# Altium project Apalis-Smart-Vision-Baseboard-Rev.1.2.1.PrjPcb (part 2 of 2)
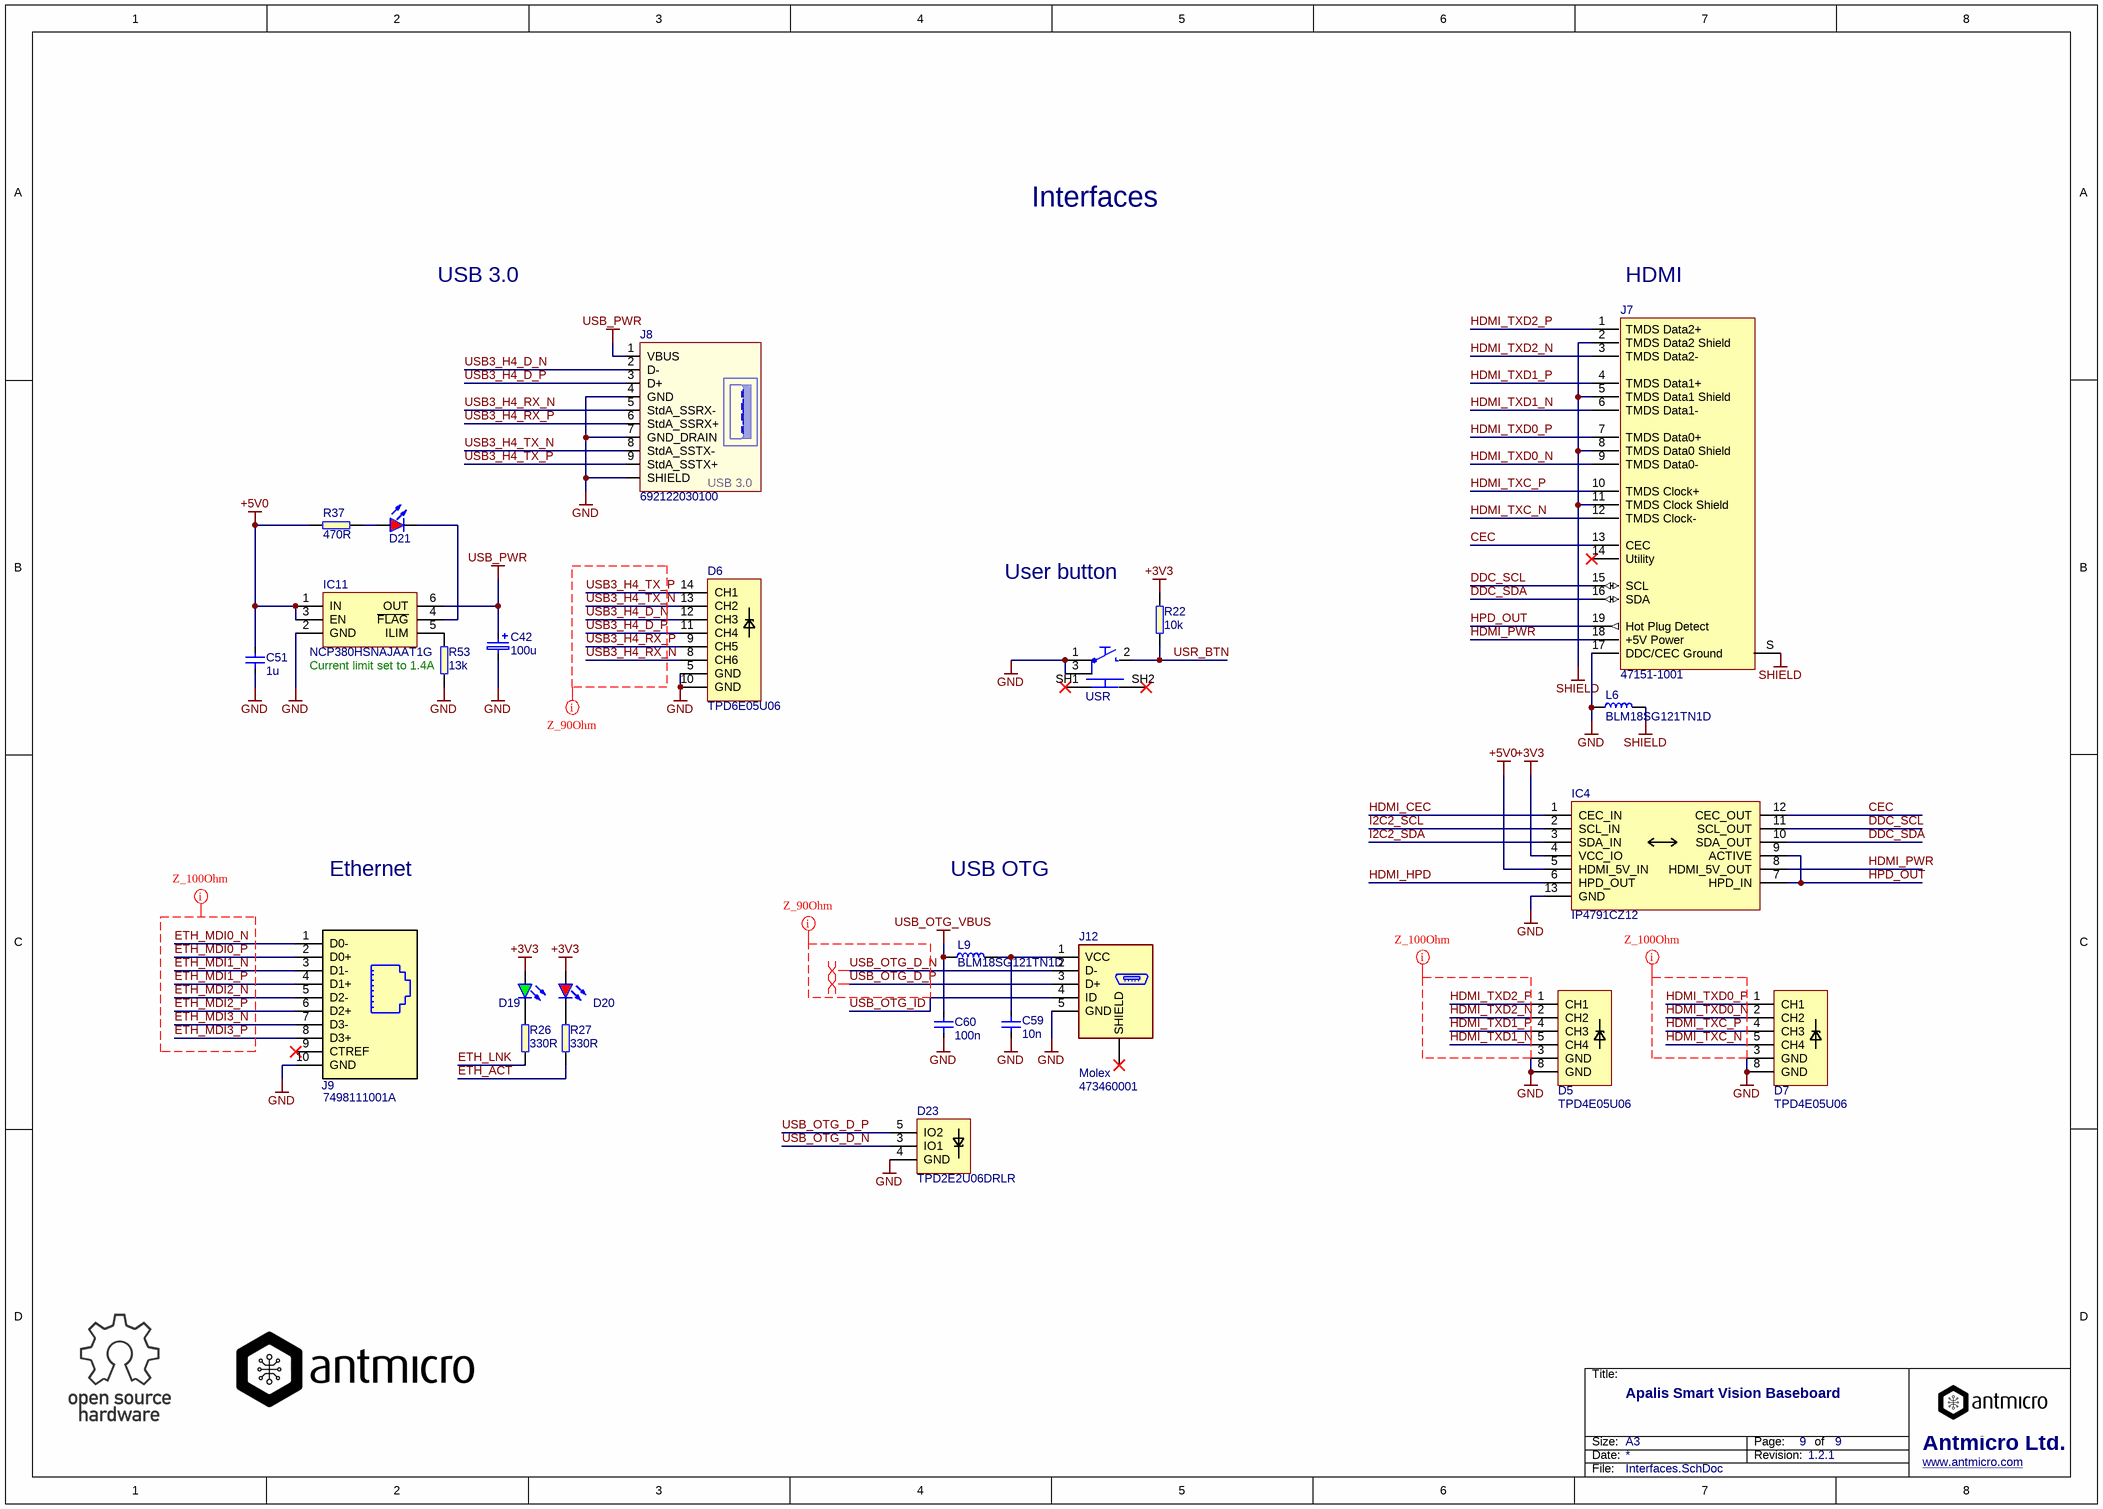
[diagram p9: Interfaces.SchDoc]

## Nets that join several sheets
+1V5: Power-Supply (C2.2 IC1.4 L1.2 TP5.1), PCIe-SATA (12 pins)
+3V3: Power-Supply (6 pins), SoM-Supply (28 pins), SoM-LowSpeed (6 pins), PCIe-SATA (23 pins), Camera-Interface (J6.47 J6.48), Peripherals (15 pins), Interfaces (D19.A D20.A IC4.4 R22.2)
+5V0: Power-Supply (7 pins), SoM-Supply (Q2.2 R10.2), Debug-UART (D3.2), Camera-Interface (J6.49 J6.50), Interfaces (5 pins)
GND: Power-Supply (31 pins), SoM-Supply (59 pins), PCIe-SATA (48 pins), Debug-UART (13 pins), Camera-Interface (24 pins), Peripherals (18 pins), Interfaces (23 pins)
USB_OTG_VBUS: SoM-HighSpeed (M1.60 TP9.1), Interfaces (C60.2 L9.1)
CSI1_CLK_N: SoM-HighSpeed (M1.161), Camera-Interface (IC23.5)
CSI1_CLK_P: SoM-HighSpeed (M1.163), Camera-Interface (IC23.4)
CSI1_D1_N: SoM-HighSpeed (M1.155), Camera-Interface (IC15.5)
CSI1_D1_P: SoM-HighSpeed (M1.157), Camera-Interface (IC15.4)
CSI1_D2_N: SoM-HighSpeed (M1.149), Camera-Interface (IC17.5)
CSI1_D2_P: SoM-HighSpeed (M1.151), Camera-Interface (IC17.4)
CSI1_D3_N: SoM-HighSpeed (M1.143), Camera-Interface (IC19.5)
CSI1_D3_P: SoM-HighSpeed (M1.145), Camera-Interface (IC19.4)
CSI1_D4_N: SoM-HighSpeed (M1.137), Camera-Interface (IC21.5)
CSI1_D4_P: SoM-HighSpeed (M1.139), Camera-Interface (IC21.4)
CSI2_CLK_N: SoM-HighSpeed (M1.131), Camera-Interface (IC22.5)
CSI2_CLK_P: SoM-HighSpeed (M1.133), Camera-Interface (IC22.4)
CSI2_D1_N: SoM-HighSpeed (M1.95), Camera-Interface (IC13.5)
CSI2_D1_P: SoM-HighSpeed (M1.97), Camera-Interface (IC13.4)
CSI3_CLK_N: SoM-HighSpeed (M1.125), Camera-Interface (IC20.5)
CSI3_CLK_P: SoM-HighSpeed (M1.127), Camera-Interface (IC20.4)
CSI3_D1_N: SoM-HighSpeed (M1.119), Camera-Interface (IC12.5)
CSI3_D1_P: SoM-HighSpeed (M1.121), Camera-Interface (IC12.4)
CSI3_D2_N: SoM-HighSpeed (M1.113), Camera-Interface (IC14.5)
CSI3_D2_P: SoM-HighSpeed (M1.115), Camera-Interface (IC14.4)
CSI3_D3_N: SoM-HighSpeed (M1.107), Camera-Interface (IC16.5)
CSI3_D3_P: SoM-HighSpeed (M1.109), Camera-Interface (IC16.4)
CSI3_D4_N: SoM-HighSpeed (M1.101), Camera-Interface (IC18.5)
CSI3_D4_P: SoM-HighSpeed (M1.103), Camera-Interface (IC18.4)
ETH_ACT: SoM-HighSpeed (M1.42), Interfaces (R27.2)
ETH_LNK: SoM-HighSpeed (M1.44), Interfaces (R26.2)
ETH_MDI0_N: SoM-HighSpeed (M1.48), Interfaces (J9.1)
ETH_MDI0_P: SoM-HighSpeed (M1.50), Interfaces (J9.2)
ETH_MDI1_N: SoM-HighSpeed (M1.54), Interfaces (J9.3)
ETH_MDI1_P: SoM-HighSpeed (M1.56), Interfaces (J9.4)
ETH_MDI2_N: SoM-HighSpeed (M1.34), Interfaces (J9.5)
ETH_MDI2_P: SoM-HighSpeed (M1.32), Interfaces (J9.6)
ETH_MDI3_N: SoM-HighSpeed (M1.40), Interfaces (J9.7)
ETH_MDI3_P: SoM-HighSpeed (M1.38), Interfaces (J9.8)
FAN_START: SoM-Supply (R12.1), SoM-LowSpeed (M1.11)
GPIO1: SoM-LowSpeed (M1.1), Camera-Interface (D12.14 J6.31)
GPIO2: SoM-LowSpeed (M1.3), Camera-Interface (D12.13 J6.32)
GPIO3: SoM-LowSpeed (M1.5), Camera-Interface (D12.12 J6.33)
GPIO4: SoM-LowSpeed (M1.7), Camera-Interface (D12.11 J6.34)
HDMI_CEC: SoM-HighSpeed (M1.220), Interfaces (IC4.1)
HDMI_HPD: SoM-HighSpeed (M1.232), Interfaces (IC4.6)
HDMI_TXC_N: SoM-HighSpeed (M1.242), Interfaces (D7.5 J7.12)
HDMI_TXC_P: SoM-HighSpeed (M1.240), Interfaces (D7.4 J7.10)
HDMI_TXD0_N: SoM-HighSpeed (M1.236), Interfaces (D7.2 J7.9)
HDMI_TXD0_P: SoM-HighSpeed (M1.234), Interfaces (D7.1 J7.7)
HDMI_TXD1_N: SoM-HighSpeed (M1.230), Interfaces (D5.5 J7.6)
HDMI_TXD1_P: SoM-HighSpeed (M1.228), Interfaces (D5.4 J7.4)
HDMI_TXD2_N: SoM-HighSpeed (M1.224), Interfaces (D5.2 J7.3)
HDMI_TXD2_P: SoM-HighSpeed (M1.222), Interfaces (D5.1 J7.1)
I2C1_SCL: SoM-LowSpeed (M1.211 R42.1 TP11.1), PCIe-SATA (R14.1), Camera-Interface (D13.8 J6.42), Peripherals (IC10.10)
I2C1_SDA: SoM-LowSpeed (M1.209 R43.1 TP10.1), PCIe-SATA (R15.1), Camera-Interface (D13.9 J6.41), Peripherals (IC10.9)
I2C2_SCL: SoM-LowSpeed (M1.207 R36.1), Interfaces (IC4.2)
I2C2_SDA: SoM-LowSpeed (M1.205 R35.1), Interfaces (IC4.3)
I2C3_SCL: SoM-LowSpeed (M1.203 R34.1 TP15.1), Camera-Interface (D13.11 J6.40), Peripherals (IC9.6)
I2C3_SDA: SoM-LowSpeed (M1.201 R33.1 TP14.1), Camera-Interface (D13.12 J6.39), Peripherals (IC9.5)
I_SENSE_3V3: Power-Supply (IC6.1), Peripherals (IC10.4)
I_SENSE_5V0: Power-Supply (IC7.1), Peripherals (IC10.5)
PCIE1_CLK_N: SoM-HighSpeed (M1.53), PCIe-SATA (J4.11)
PCIE1_CLK_P: SoM-HighSpeed (M1.55), PCIe-SATA (J4.13)
PCIE1_RX_N: SoM-HighSpeed (M1.41), PCIe-SATA (J4.23)
PCIE1_RX_P: SoM-HighSpeed (M1.43), PCIe-SATA (J4.25)
PCIE1_TX_N: SoM-HighSpeed (M1.47), PCIe-SATA (J4.31)
PCIE1_TX_P: SoM-HighSpeed (M1.49), PCIe-SATA (J4.33)
PEN: Power-Supply (IC3.13 R9.2), SoM-Supply (Q1.2 R25.2), SoM-LowSpeed (M1.24)
RST_IN: SoM-Supply (RST.2), SoM-LowSpeed (M1.28)
RST_OUT: SoM-LowSpeed (M1.26), PCIe-SATA (J4.22)
SATA_RX_N: SoM-HighSpeed (M1.27), PCIe-SATA (J2.25)
SATA_RX_P: SoM-HighSpeed (M1.25), PCIe-SATA (J2.23)
SATA_TX_N: SoM-HighSpeed (M1.31), PCIe-SATA (J2.31)
SATA_TX_P: SoM-HighSpeed (M1.33), PCIe-SATA (J2.33)
SD_CD: SoM-LowSpeed (M1.164), Peripherals (C56.2 D9.1 J5.9 R46.1)
SD_CLK: SoM-LowSpeed (M1.154), Peripherals (D9.5 J5.5)
SD_CMD: SoM-LowSpeed (M1.150), Peripherals (D22.1 J5.3 R18.1)
SD_D0: SoM-LowSpeed (M1.160), Peripherals (D9.4 J5.7 R17.1)
SD_D1: SoM-LowSpeed (M1.162), Peripherals (D9.2 J5.8 R16.1)
SD_D2: SoM-LowSpeed (M1.144), Peripherals (D22.4 J5.1 R21.1)
SD_D3: SoM-LowSpeed (M1.146), Peripherals (D22.2 J5.2 R20.1)
SPI_CS: SoM-LowSpeed (M1.227), Camera-Interface (D14.11 J6.46)
SPI_MISO: SoM-LowSpeed (M1.223), Camera-Interface (D14.13 J6.44)
SPI_MOSI: SoM-LowSpeed (M1.225), Camera-Interface (D14.12 J6.45)
SPI_SCK: SoM-LowSpeed (M1.221), Camera-Interface (D14.14 J6.43)
UART1_RX: SoM-LowSpeed (M1.118), Debug-UART (IC5.30)
UART1_TX: SoM-LowSpeed (M1.112), Debug-UART (IC5.2)
UART3_RX: SoM-LowSpeed (M1.136), Camera-Interface (D12.8 J6.36)
UART3_TX: SoM-LowSpeed (M1.134), Camera-Interface (D12.9 J6.35)
UART4_RX: SoM-LowSpeed (M1.140), Camera-Interface (D13.13 J6.38)
UART4_TX: SoM-LowSpeed (M1.138), Camera-Interface (D13.14 J6.37)
USB3_H4_D_N: SoM-HighSpeed (M1.100), Interfaces (D6.12 J8.2)
USB3_H4_D_P: SoM-HighSpeed (M1.98), Interfaces (D6.11 J8.3)
USB3_H4_RX_N: SoM-HighSpeed (M1.92), Interfaces (D6.8 J8.5)
USB3_H4_RX_P: SoM-HighSpeed (M1.94), Interfaces (D6.9 J8.6)
USB3_H4_TX_N: SoM-HighSpeed (M1.104), Interfaces (D6.13 J8.8)
USB3_H4_TX_P: SoM-HighSpeed (M1.106), Interfaces (D6.14 J8.9)
USB_OTG_D_N: SoM-HighSpeed (M1.76 TP7.1), Interfaces (D23.3 J12.2)
USB_OTG_D_P: SoM-HighSpeed (M1.74 TP6.1), Interfaces (D23.5 J12.3)
USB_OTG_ID: SoM-HighSpeed (M1.72 TP8.1), Interfaces (J12.4)
USBH2_D_N: SoM-HighSpeed (M1.82), PCIe-SATA (J4.36)
USBH2_D_P: SoM-HighSpeed (M1.80), PCIe-SATA (J4.38)
USR_BTN: SoM-LowSpeed (M1.17), Interfaces (R22.1 USR.2)
WAKE: SoM-LowSpeed (M1.37), PCIe-SATA (J4.1)

## Assembly variants
Production: not fitted R12 R19 R35 R36